# Altium project 继电器板.PrjPcb
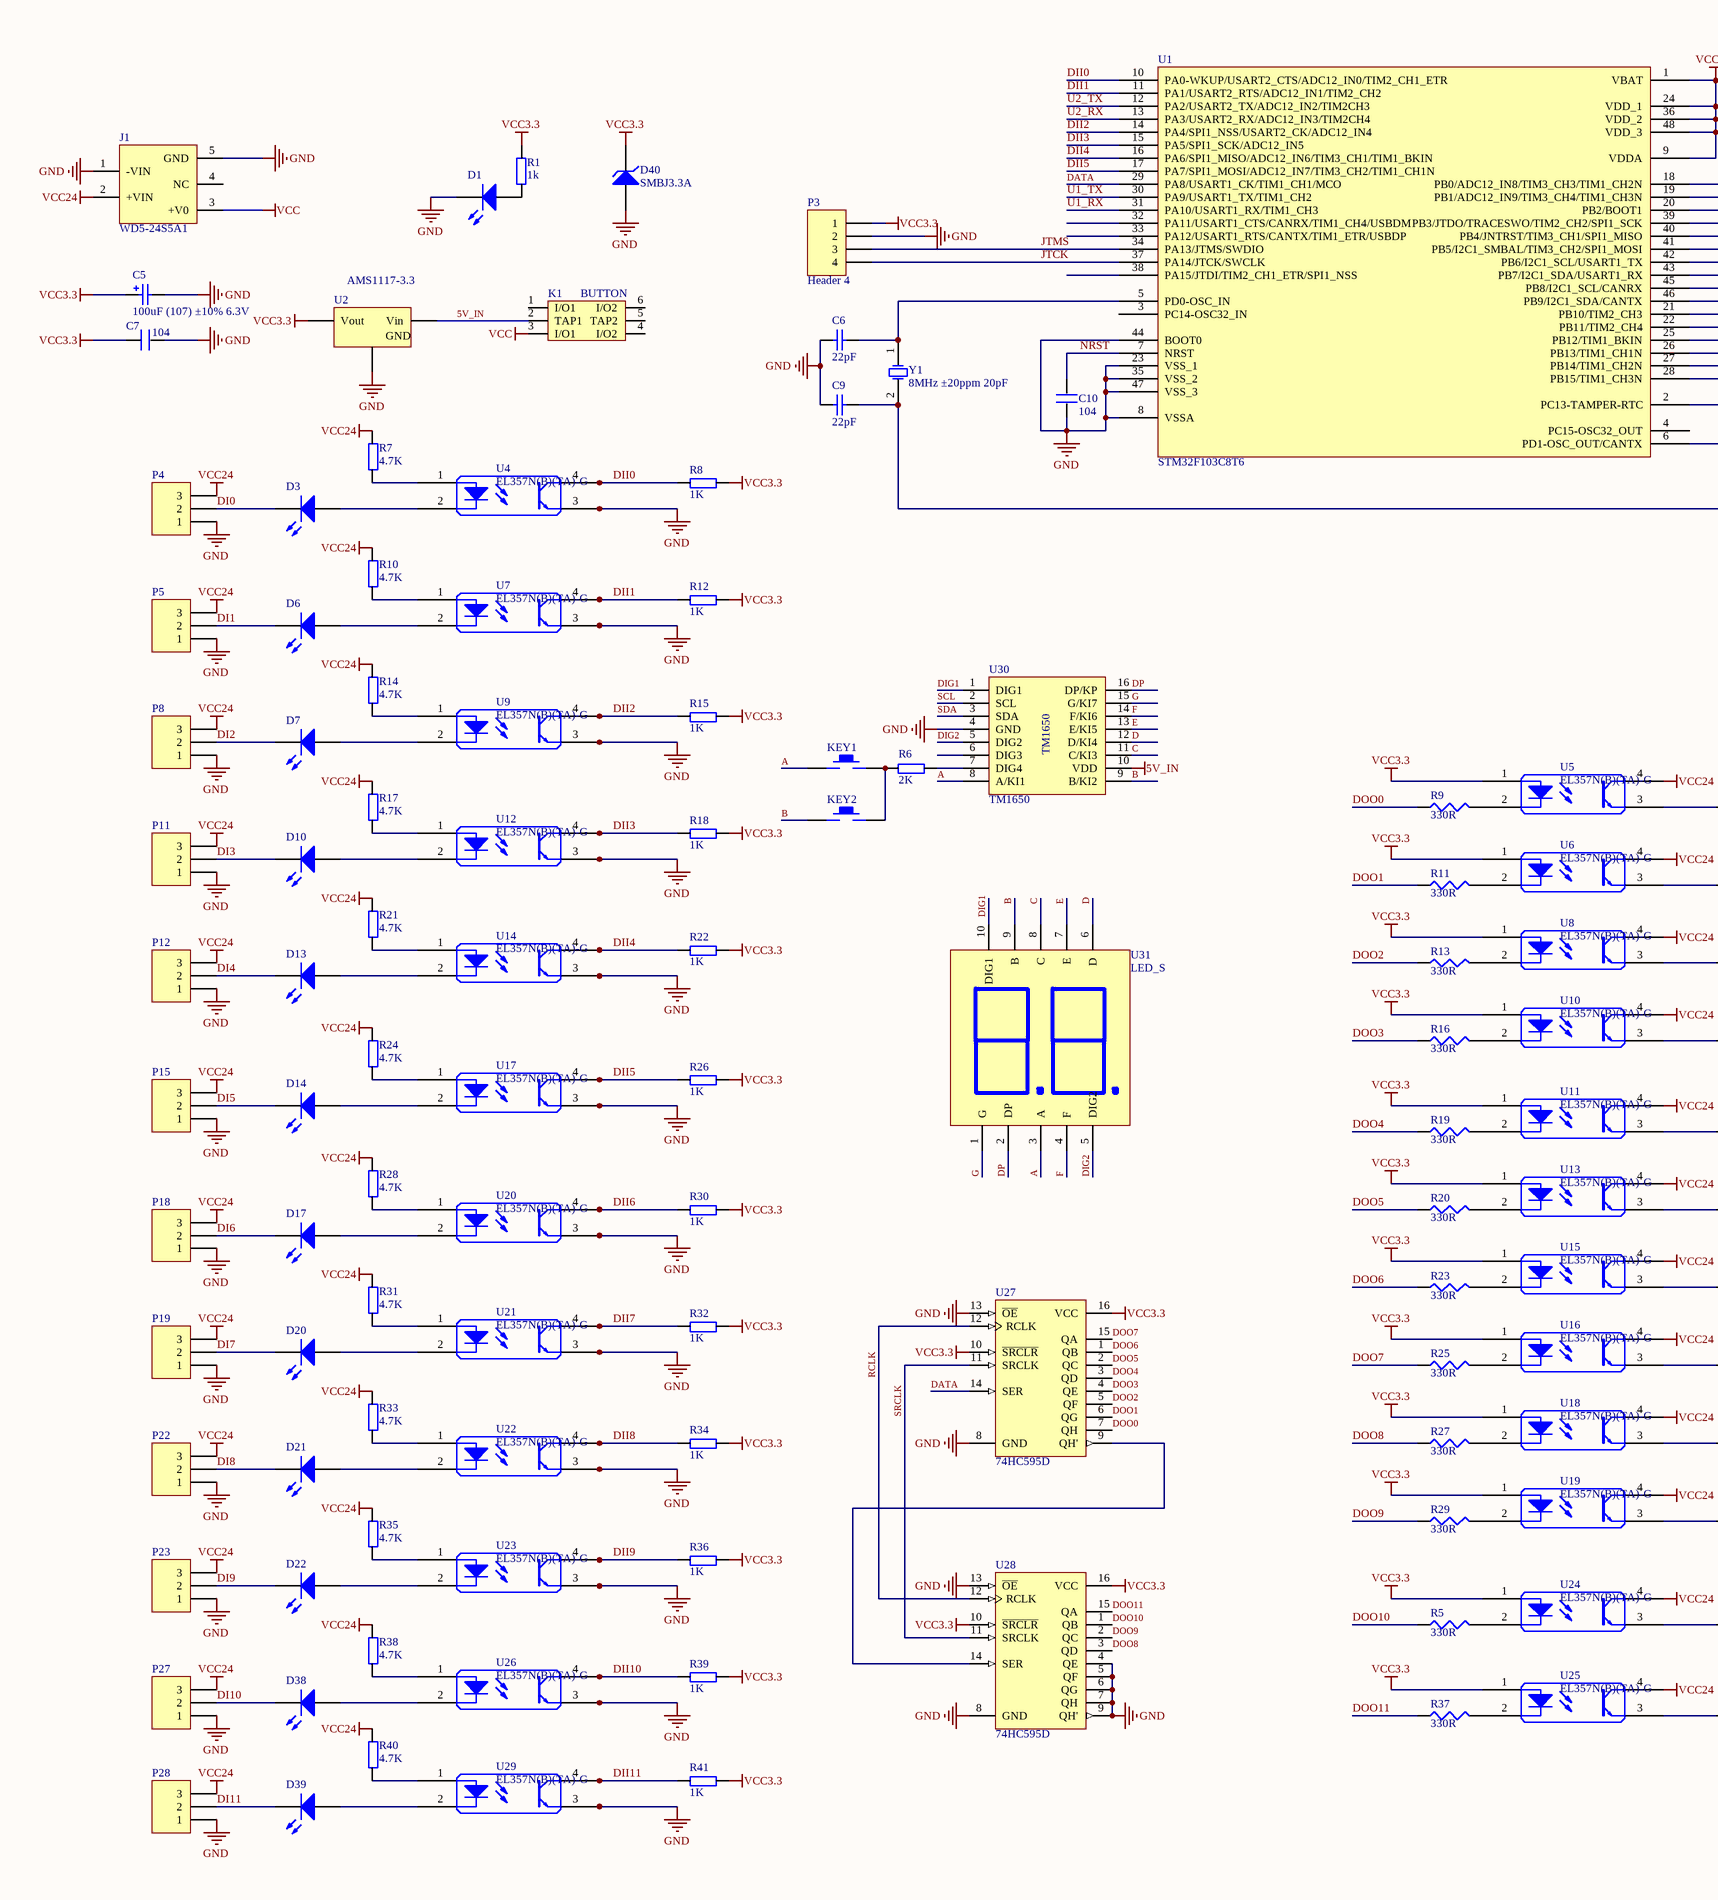
[diagram p0: 继电器板.SchDoc, left]
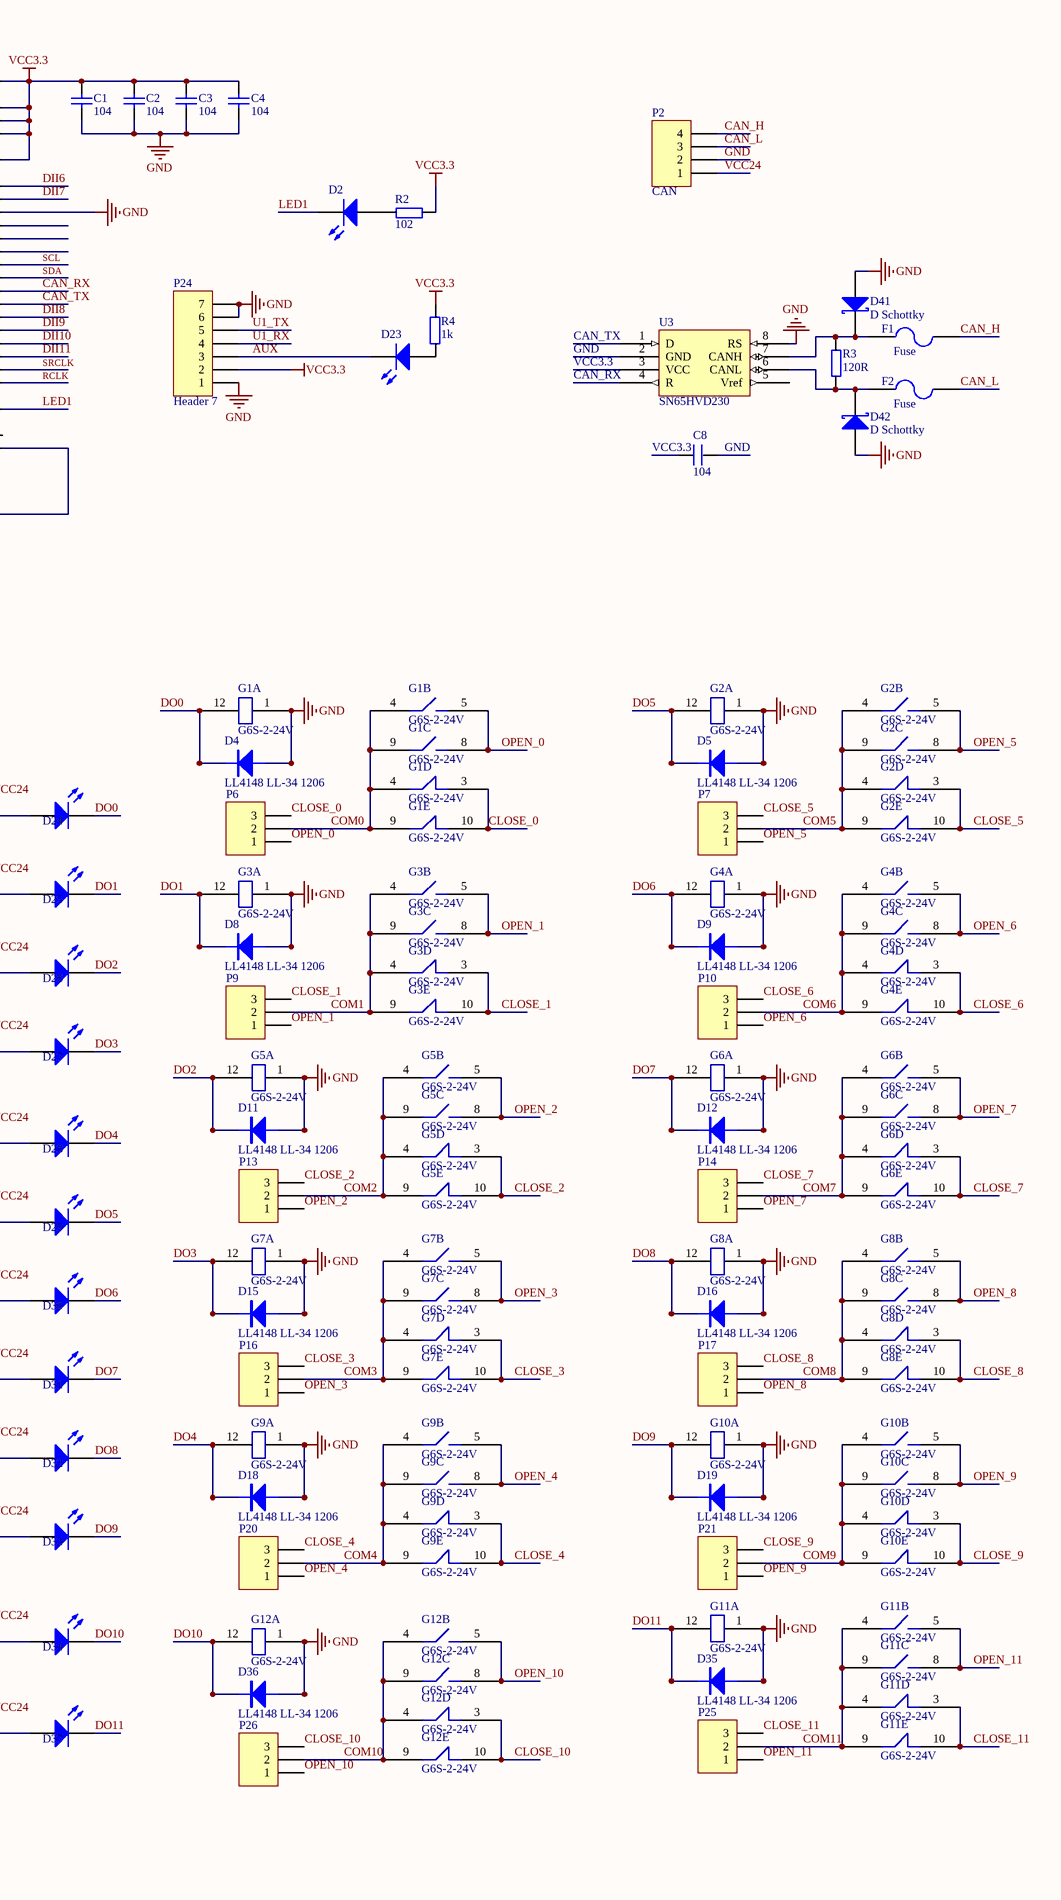
[diagram p1: 继电器板.SchDoc, right]
1 sheet, 170 parts. Net scope: global (net labels, ports and power ports of the same name join across sheets).
Board files: 继电器板.PcbDoc, 尺寸.PcbDoc

## Sheet 继电器板.SchDoc
size A2

### Parts
C1  104  [0603_C]
C2  104  [0603_C]
C3  104  [0603_C]
C4  104  [0603_C]
C5  100uF (107) ±10% 6.3V  [CASE-B_3528]
C6  22pF  [0603_C]
C7  104  [0603_C]
C8  104  [0603_C]
C9  22pF  [0603_C]
C10  104  [0603_C]
D1  蓝灯 0805  [LC-0805_LED_S1]  (value not drawn)
D2  红灯 0805  [LC-0805_LED_S1]  (value not drawn)
D3  红灯 0805  [LC-0805_LED_S1]  (value not drawn)
D4  LL4148 LL-34 1206  [LC-LL-34]
D5  LL4148 LL-34 1206  [LC-LL-34]
D6  红灯 0805  [LC-0805_LED_S1]  (value not drawn)
D7  红灯 0805  [LC-0805_LED_S1]  (value not drawn)
D8  LL4148 LL-34 1206  [LC-LL-34]
D9  LL4148 LL-34 1206  [LC-LL-34]
D10  红灯 0805  [LC-0805_LED_S1]  (value not drawn)
D11  LL4148 LL-34 1206  [LC-LL-34]
D12  LL4148 LL-34 1206  [LC-LL-34]
D13  红灯 0805  [LC-0805_LED_S1]  (value not drawn)
D14  红灯 0805  [LC-0805_LED_S1]  (value not drawn)
D15  LL4148 LL-34 1206  [LC-LL-34]
D16  LL4148 LL-34 1206  [LC-LL-34]
D17  红灯 0805  [LC-0805_LED_S1]  (value not drawn)
D18  LL4148 LL-34 1206  [LC-LL-34]
D19  LL4148 LL-34 1206  [LC-LL-34]
D20  红灯 0805  [LC-0805_LED_S1]  (value not drawn)
D21  红灯 0805  [LC-0805_LED_S1]  (value not drawn)
D22  红灯 0805  [LC-0805_LED_S1]  (value not drawn)
D23  红灯 0805  [LC-0805_LED_S1]  (value not drawn)
D24  红灯 0805  [LC-0805_LED_S1]  (value not drawn)
D25  红灯 0805  [LC-0805_LED_S1]  (value not drawn)
D26  红灯 0805  [LC-0805_LED_S1]  (value not drawn)
D27  红灯 0805  [LC-0805_LED_S1]  (value not drawn)
D28  红灯 0805  [LC-0805_LED_S1]  (value not drawn)
D29  红灯 0805  [LC-0805_LED_S1]  (value not drawn)
D30  红灯 0805  [LC-0805_LED_S1]  (value not drawn)
D31  红灯 0805  [LC-0805_LED_S1]  (value not drawn)
D32  红灯 0805  [LC-0805_LED_S1]  (value not drawn)
D33  红灯 0805  [LC-0805_LED_S1]  (value not drawn)
D34  红灯 0805  [LC-0805_LED_S1]  (value not drawn)
D35  LL4148 LL-34 1206  [LC-LL-34]
D36  LL4148 LL-34 1206  [LC-LL-34]
D37  红灯 0805  [LC-0805_LED_S1]  (value not drawn)
D38  红灯 0805  [LC-0805_LED_S1]  (value not drawn)
D39  红灯 0805  [LC-0805_LED_S1]  (value not drawn)
D40  SMBJ3.3A  [SMB(DO-214AA)_S1]
D41  D Schottky  [SMB]
D42  D Schottky  [SMB]
F1  Fuse  [12Z-2010]
F2  Fuse  [12Z-2010]
G1  G6S-2-24V  [G6S-2-24V]  (parts A,B,C,D,E of 5)
G2  G6S-2-24V  [G6S-2-24V]  (parts A,B,C,D,E of 5)
G3  G6S-2-24V  [G6S-2-24V]  (parts A,B,C,D,E of 5)
G4  G6S-2-24V  [G6S-2-24V]  (parts A,B,C,D,E of 5)
G5  G6S-2-24V  [G6S-2-24V]  (parts A,B,C,D,E of 5)
G6  G6S-2-24V  [G6S-2-24V]  (parts A,B,C,D,E of 5)
G7  G6S-2-24V  [G6S-2-24V]  (parts A,B,C,D,E of 5)
G8  G6S-2-24V  [G6S-2-24V]  (parts A,B,C,D,E of 5)
G9  G6S-2-24V  [G6S-2-24V]  (parts A,B,C,D,E of 5)
G10  G6S-2-24V  [G6S-2-24V]  (parts A,B,C,D,E of 5)
G11  G6S-2-24V  [G6S-2-24V]  (parts A,B,C,D,E of 5)
G12  G6S-2-24V  [G6S-2-24V]  (parts A,B,C,D,E of 5)
J1  WD5-24S5A1  [WD5-24S3V3]
K1  BUTTON  [BTN8.5*8.5]
KEY1  KEY_M  [SW_PB2_A1]  (value not drawn)
KEY2  KEY_M  [SW_PB2_A1]  (value not drawn)
P2  CAN  [DZ-4-3.5]
P3  Header 4  [IDE4]
P4  (no value)  [DZ-3-3.5]
P5  (no value)  [DZ-3-3.5]
P6  (no value)  [DZ-3-3.5]
P7  (no value)  [DZ-3-3.5]
P8  (no value)  [DZ-3-3.5]
P9  (no value)  [DZ-3-3.5]
P10  (no value)  [DZ-3-3.5]
P11  (no value)  [DZ-3-3.5]
P12  (no value)  [DZ-3-3.5]
P13  (no value)  [DZ-3-3.5]
P14  (no value)  [DZ-3-3.5]
P15  (no value)  [DZ-3-3.5]
P16  (no value)  [DZ-3-3.5]
P17  (no value)  [DZ-3-3.5]
P18  (no value)  [DZ-3-3.5]
P19  (no value)  [DZ-3-3.5]
P20  (no value)  [DZ-3-3.5]
P21  (no value)  [DZ-3-3.5]
P22  (no value)  [DZ-3-3.5]
P23  (no value)  [DZ-3-3.5]
P24  Header 7  [AS50-T27]
P25  (no value)  [DZ-3-3.5]
P26  (no value)  [DZ-3-3.5]
P27  (no value)  [DZ-3-3.5]
P28  (no value)  [DZ-3-3.5]
R1  1k  [0603_R]
R2  102  [0603_R]
R3  120R  [0805]
R4  1k  [0603_R]
R5  330R  [0603_R]
R6  2K  [0603_R]
R7  4.7K  [0603_R]
R8  1K  [0603_R]
R9  330R  [0603_R]
R10  4.7K  [0603_R]
R11  330R  [0603_R]
R12  1K  [0603_R]
R13  330R  [0603_R]
R14  4.7K  [0603_R]
R15  1K  [0603_R]
R16  330R  [0603_R]
R17  4.7K  [0603_R]
R18  1K  [0603_R]
R19  330R  [0603_R]
R20  330R  [0603_R]
R21  4.7K  [0603_R]
R22  1K  [0603_R]
R23  330R  [0603_R]
R24  4.7K  [0603_R]
R25  330R  [0603_R]
R26  1K  [0603_R]
R27  330R  [0603_R]
R28  4.7K  [0603_R]
R29  330R  [0603_R]
R30  1K  [0603_R]
R31  4.7K  [0603_R]
R32  1K  [0603_R]
R33  4.7K  [0603_R]
R34  1K  [0603_R]
R35  4.7K  [0603_R]
R36  1K  [0603_R]
R37  330R  [0603_R]
R38  4.7K  [0603_R]
R39  1K  [0603_R]
R40  4.7K  [0603_R]
R41  1K  [0603_R]
U1  STM32F103C8T6  [LC-LQFP-48]
U2  AMS1117-3.3  [SOT-223]
U3  SN65HVD230  [LC-SOIC-8_150mil]
U4  EL357N(B)(TA)-G  [LC-SOP-4_P2.54]
U5  EL357N(B)(TA)-G  [LC-SOP-4_P2.54]
U6  EL357N(B)(TA)-G  [LC-SOP-4_P2.54]
U7  EL357N(B)(TA)-G  [LC-SOP-4_P2.54]
U8  EL357N(B)(TA)-G  [LC-SOP-4_P2.54]
U9  EL357N(B)(TA)-G  [LC-SOP-4_P2.54]
U10  EL357N(B)(TA)-G  [LC-SOP-4_P2.54]
U11  EL357N(B)(TA)-G  [LC-SOP-4_P2.54]
U12  EL357N(B)(TA)-G  [LC-SOP-4_P2.54]
U13  EL357N(B)(TA)-G  [LC-SOP-4_P2.54]
U14  EL357N(B)(TA)-G  [LC-SOP-4_P2.54]
U15  EL357N(B)(TA)-G  [LC-SOP-4_P2.54]
U16  EL357N(B)(TA)-G  [LC-SOP-4_P2.54]
U17  EL357N(B)(TA)-G  [LC-SOP-4_P2.54]
U18  EL357N(B)(TA)-G  [LC-SOP-4_P2.54]
U19  EL357N(B)(TA)-G  [LC-SOP-4_P2.54]
U20  EL357N(B)(TA)-G  [LC-SOP-4_P2.54]
U21  EL357N(B)(TA)-G  [LC-SOP-4_P2.54]
U22  EL357N(B)(TA)-G  [LC-SOP-4_P2.54]
U23  EL357N(B)(TA)-G  [LC-SOP-4_P2.54]
U24  EL357N(B)(TA)-G  [LC-SOP-4_P2.54]
U25  EL357N(B)(TA)-G  [LC-SOP-4_P2.54]
U26  EL357N(B)(TA)-G  [LC-SOP-4_P2.54]
U27  74HC595D  [SOIC-16_150mil]
U28  74HC595D  [SOIC-16_150mil]
U29  EL357N(B)(TA)-G  [LC-SOP-4_P2.54]
U30  TM1650  [SO-16]
U31  LED_S
Y1  8MHz ±20ppm 20pF  [SMD-5032_2P]

### Nets
5V_IN: K1.2(TAP1) U2.3(Vin) U30.10(VDD)
GND: C1.2 C2.2 C3.2 C4.2 C5.2 C6.2 C7.1 C8.2 C9.2 C10.1 D1.K D4.1(A) D5.1(A) D8.1(A) D9.1(A) D11.1(A) D12.1(A) D15.1(A) D16.1(A) D18.1(A) D19.1(A) D35.1(A) D36.1(A) D40.1(A) D41.1(A) D42.1(A) G1.1 G2.1 G3.1 G4.1 G5.1 G6.1 G7.1 G8.1 G9.1 G10.1 G11.1 G12.1 J1.1(-VIN) J1.5(GND) P2.2 P3.2 P4.1 P5.1 P8.1 P11.1 P12.1 P15.1 P18.1 P19.1 P22.1 P23.1 P24.1 P24.6 P24.7 P27.1 P28.1 U1.8(VSSA) U1.20(PB2/BOOT1) U1.23(VSS_1) U1.35(VSS_2) U1.44(BOOT0) U1.47(VSS_3) U2.1(GND) U3.2(GND) U3.8(RS) U4.3 U7.3 U9.3 U12.3 U14.3 U17.3 U20.3 U21.3 U22.3 U23.3 U26.3 U27.8(GND) U27.13(~{OE}) U28.4(QE) U28.5(QF) U28.6(QG) U28.7(QH) U28.8(GND) U28.9(QH') U28.13(~{OE}) U29.3 U30.4(GND)
VCC: J1.3(+V0) K1.3(I/O1)
VCC3.3: C1.1 C2.1 C3.1 C4.1 C5.1 C7.2 C8.1 D40.2(K) P3.1 P24.2 R1.1 R2.2 R4.1 R8.2 R12.2 R15.2 R18.2 R22.2 R26.2 R30.2 R32.2 R34.2 R36.2 R39.2 R41.2 U1.1(VBAT) U1.9(VDDA) U1.24(VDD_1) U1.36(VDD_2) U1.48(VDD_3) U2.2(Vout) U3.3(VCC) U5.1 U6.1 U8.1 U10.1 U11.1 U13.1 U15.1 U16.1 U18.1 U19.1 U24.1 U25.1 U27.10(~{SRCLR}) U27.16(VCC) U28.10(~{SRCLR}) U28.16(VCC)
VCC24: J1.2(+VIN) P2.1 P4.3 P5.3 P8.3 P11.3 P12.3 P15.3 P18.3 P19.3 P22.3 P23.3 P27.3 P28.3 R7.2 R10.2 R14.2 R17.2 R21.2 R24.2 R28.2 R31.2 R33.2 R35.2 R38.2 R40.2 U5.4 U6.4 U8.4 U10.4 U11.4 U13.4 U15.4 U16.4 U18.4 U19.4 U24.4 U25.4
A: KEY1.1 U30.8(A/KI1) U31.3(A)
AUX: D23.K P24.3
B: KEY2.1 U30.9(B/KI2) U31.9(B)
C: U30.11(C/KI3) U31.8(C)
CAN_H: F1.1 P2.4
CAN_L: F2.1 P2.3
CAN_RX: U1.45(PB8/I2C1_SCL/CANRX) U3.4(R)
CAN_TX: U1.46(PB9/I2C1_SDA/CANTX) U3.1(D)
CLOSE_0: G1.3 G1.10 P6.3
CLOSE_1: G3.3 G3.10 P9.3
CLOSE_2: G5.3 G5.10 P13.3
CLOSE_3: G7.3 G7.10 P16.3
CLOSE_4: G9.3 G9.10 P20.3
CLOSE_5: G2.3 G2.10 P7.3
CLOSE_6: G4.3 G4.10 P10.3
CLOSE_7: G6.3 G6.10 P14.3
CLOSE_8: G8.3 G8.10 P17.3
CLOSE_9: G10.3 G10.10 P21.3
CLOSE_10: G12.3 G12.10 P26.3
CLOSE_11: G11.3 G11.10 P25.3
COM0: G1.4 G1.9 P6.2
COM1: G3.4 G3.9 P9.2
COM2: G5.4 G5.9 P13.2
COM3: G7.4 G7.9 P16.2
COM4: G9.4 G9.9 P20.2
COM5: G2.4 G2.9 P7.2
COM6: G4.4 G4.9 P10.2
COM7: G6.4 G6.9 P14.2
COM8: G8.4 G8.9 P17.2
COM9: G10.4 G10.9 P21.2
COM10: G12.4 G12.9 P26.2
COM11: G11.4 G11.9 P25.2
D: U30.12(D/KI4) U31.6(D)
DATA: U1.29(PA8/USART1_CK/TIM1_CH1/MCO) U27.14(SER)
DI0: D3.K P4.2
DI1: D6.K P5.2
DI2: D7.K P8.2
DI3: D10.K P11.2
DI4: D13.K P12.2
DI5: D14.K P15.2
DI6: D17.K P18.2
DI7: D20.K P19.2
DI8: D21.K P22.2
DI9: D22.K P23.2
DI10: D38.K P27.2
DI11: D39.K P28.2
DIG1: U30.1(DIG1) U31.10(DIG1)
DIG2: U30.5(DIG2) U31.5(DIG2)
DII0: R8.1 U1.10(PA0-WKUP/USART2_CTS/ADC12_IN0/TIM2_CH1_ETR) U4.4
DII1: R12.1 U1.11(PA1/USART2_RTS/ADC12_IN1/TIM2_CH2) U7.4
DII2: R15.1 U1.14(PA4/SPI1_NSS/USART2_CK/ADC12_IN4) U9.4
DII3: R18.1 U1.15(PA5/SPI1_SCK/ADC12_IN5) U12.4
DII4: R22.1 U1.16(PA6/SPI1_MISO/ADC12_IN6/TIM3_CH1/TIM1_BKIN) U14.4
DII5: R26.1 U1.17(PA7/SPI1_MOSI/ADC12_IN7/TIM3_CH2/TIM1_CH1N) U17.4
DII6: R30.1 U1.18(PB0/ADC12_IN8/TIM3_CH3/TIM1_CH2N) U20.4
DII7: R32.1 U1.19(PB1/ADC12_IN9/TIM3_CH4/TIM1_CH3N) U21.4
DII8: R34.1 U1.21(PB10/TIM2_CH3) U22.4
DII9: R36.1 U1.22(PB11/TIM2_CH4) U23.4
DII10: R39.1 U1.25(PB12/TIM1_BKIN) U26.4
DII11: R41.1 U1.26(PB13/TIM1_CH1N) U29.4
DO0: D4.2(K) D24.K G1.12
DO1: D8.2(K) D25.K G3.12
DO2: D11.2(K) D26.K G5.12
DO3: D15.2(K) D27.K G7.12
DO4: D18.2(K) D28.K G9.12
DO5: D5.2(K) D29.K G2.12
DO6: D9.2(K) D30.K G4.12
DO7: D12.2(K) D31.K G6.12
DO8: D16.2(K) D32.K G8.12
DO9: D19.2(K) D33.K G10.12
DO10: D34.K D36.2(K) G12.12
DO11: D35.2(K) D37.K G11.12
DOO0: R9.1 U27.7(QH)
DOO1: R11.1 U27.6(QG)
DOO2: R13.1 U27.5(QF)
DOO3: R16.1 U27.4(QE)
DOO4: R19.1 U27.3(QD)
DOO5: R20.1 U27.2(QC)
DOO6: R23.1 U27.1(QB)
DOO7: R25.1 U27.15(QA)
DOO8: R27.1 U28.3(QD)
DOO9: R29.1 U28.2(QC)
DOO10: R5.1 U28.1(QB)
DOO11: R37.1 U28.15(QA)
DP: U30.16(DP/KP) U31.2(DP)
E: U30.13(E/KI5) U31.7(E)
F: U30.14(F/KI6) U31.4(F)
G: U30.15(G/KI7) U31.1(G)
JTCK: P3.4 U1.37(PA14/JTCK/SWCLK)
JTMS: P3.3 U1.34(PA13/JTMS/SWDIO)
LED1: D2.K U1.2(PC13-TAMPER-RTC)
NRST: C10.2 U1.7(NRST)
OPEN_0: G1.5 G1.8 P6.1
OPEN_1: G3.5 G3.8 P9.1
OPEN_2: G5.5 G5.8 P13.1
OPEN_3: G7.5 G7.8 P16.1
OPEN_4: G9.5 G9.8 P20.1
OPEN_5: G2.5 G2.8 P7.1
OPEN_6: G4.5 G4.8 P10.1
OPEN_7: G6.5 G6.8 P14.1
OPEN_8: G8.5 G8.8 P17.1
OPEN_9: G10.5 G10.8 P21.1
OPEN_10: G12.5 G12.8 P26.1
OPEN_11: G11.5 G11.8 P25.1
RCLK: U1.28(PB15/TIM1_CH3N) U27.12(RCLK) U28.12(RCLK)
SCL: U1.42(PB6/I2C1_SCL/USART1_TX) U30.2(SCL)
SDA: U1.43(PB7/I2C1_SDA/USART1_RX) U30.3(SDA)
SRCLK: U1.27(PB14/TIM1_CH2N) U27.11(SRCLK) U28.11(SRCLK)
U1_RX: P24.4 U1.31(PA10/USART1_RX/TIM1_CH3)
U1_TX: P24.5 U1.30(PA9/USART1_TX/TIM1_CH2)
U2_RX: U1.13(PA3/USART2_RX/ADC12_IN3/TIM2CH4)
U2_TX: U1.12(PA2/USART2_TX/ADC12_IN2/TIM2CH3)
NetC6_1: C6.1 U1.5(PD0-OSC_IN) Y1.1(OSC1)
NetC9_1: C9.1 U1.6(PD1-OSC_OUT/CANTX) Y1.2(OSC2)
NetD1_A: D1.A R1.2
NetD2_A: D2.A R2.1
NetD3_A: D3.A U4.2
NetD6_A: D6.A U7.2
NetD7_A: D7.A U9.2
NetD10_A: D10.A U12.2
NetD13_A: D13.A U14.2
NetD14_A: D14.A U17.2
NetD17_A: D17.A U20.2
NetD20_A: D20.A U21.2
NetD21_A: D21.A U22.2
NetD22_A: D22.A U23.2
NetD23_A: D23.A R4.2
NetD24_A: D24.A U5.3
NetD25_A: D25.A U6.3
NetD26_A: D26.A U8.3
NetD27_A: D27.A U10.3
NetD28_A: D28.A U11.3
NetD29_A: D29.A U13.3
NetD30_A: D30.A U15.3
NetD31_A: D31.A U16.3
NetD32_A: D32.A U18.3
NetD33_A: D33.A U19.3
NetD34_A: D34.A U24.3
NetD37_A: D37.A U25.3
NetD38_A: D38.A U26.2
NetD39_A: D39.A U29.2
NetD41_2: D41.2(K) F1.2 R3.2 U3.7(CANH)
NetD42_2: D42.2(K) F2.2 R3.1 U3.6(CANL)
NetKEY1_2: KEY1.2 KEY2.2 R6.1
NetR5_2: R5.2 U24.2
NetR6_2: R6.2 U30.7(DIG4)
NetR7_1: R7.1 U4.1
NetR9_2: R9.2 U5.2
NetR10_1: R10.1 U7.1
NetR11_2: R11.2 U6.2
NetR13_2: R13.2 U8.2
NetR14_1: R14.1 U9.1
NetR16_2: R16.2 U10.2
NetR17_1: R17.1 U12.1
NetR19_2: R19.2 U11.2
NetR20_2: R20.2 U13.2
NetR21_1: R21.1 U14.1
NetR23_2: R23.2 U15.2
NetR24_1: R24.1 U17.1
NetR25_2: R25.2 U16.2
NetR27_2: R27.2 U18.2
NetR28_1: R28.1 U20.1
NetR29_2: R29.2 U19.2
NetR31_1: R31.1 U21.1
NetR33_1: R33.1 U22.1
NetR35_1: R35.1 U23.1
NetR37_2: R37.2 U25.2
NetR38_1: R38.1 U26.1
NetR40_1: R40.1 U29.1
NetU27_9: U27.9(QH') U28.14(SER)

Not connected (* = marked no-connect by the designer): J1 4(NC); K1 1(I/O1) 4(I/O2) 5(TAP2) 6(I/O2); U1 3(PC14-OSC32_IN) 4(PC15-OSC32_OUT) 32(PA11/USART1_CTS/CANRX/TIM1_CH4/USBDM) 33(PA12/USART1_RTS/CANTX/TIM1_ETR/USBDP) 38(PA15/JTDI/TIM2_CH1_ETR/SPI1_NSS) 39(PB3/JTDO/TRACESWO/TIM2_CH2/SPI1_SCK) 40(PB4/JNTRST/TIM3_CH1/SPI1_MISO) 41(PB5/I2C1_SMBAL/TIM3_CH2/SPI1_MOSI); U3 5(Vref); U30 6(DIG3)

### Library data of the parts
C1-C4 C9 = Cap: Capacitor; Published: 8-Jun-2000; LatestRevisionDate: 17-Jul-2002; LatestRevisionNote: Re-released for DXP Platform.; PackageReference: RAD-0.3; Publisher: Altium Limited; PackageDescription: Radial Cap, Thru-Hole; 2 Leads; 0.3 in Pin Spacing
  C1-C4: Value: 104
  C9: Value: 22pF
C5 = 3528 100uF (107) 10% 6.3V: 钽电容; ComponentLink1Description: 供应商链接; ComponentLink1URL: http://www.szlcsc.com/product/details_16815.html; Package: 3528; Supplier: LC; SuppliersPartNumber: C16133
C6 = Cap: Capacitor; Value: 22p; Published: 8-Jun-2000; LatestRevisionDate: 17-Jul-2002; LatestRevisionNote: Re-released for DXP Platform.; PackageReference: RAD-0.3; Publisher: Altium Limited; PackageDescription: Radial Cap, Thru-Hole; 2 Leads; 0.3 in Pin Spacing
C7 C10 = C
C8 = C_3
D1-D3 D6 D7 D10 D13 D14 D17 D20-D34 D37-D39 = LED0: Typical INFRARED GaAs LED; Published: 8-Jun-2000; LatestRevisionDate: 08-Jul-2005; LatestRevisionNote: Mech Layer 1 removed.; PackageReference: LED-0; Publisher: Altium Limited; PackageDescription: LED; 2 Leads
D4 D5 D8 D9 D11 D12 D15 D16 D18 D19 D35 D36 = DIODE
D40 = D Zener: Zener Diode; Published: 8-Jun-2000; LatestRevisionDate: 17-Jul-2002; LatestRevisionNote: Re-released for DXP Platform.; PackageReference: DIODE-0.7; Publisher: Altium Limited; PackageDescription: Diode, Thru-Hole; 2 Leads; 0.7 in Pin Spacing
D41 D42 = D Schottky: Schottky Diode; Published: 8-Jun-2000; LatestRevisionDate: 17-Jul-2002; LatestRevisionNote: Re-released for DXP Platform.; PackageReference: SMB; Publisher: Altium Limited; PackageDescription: DO-214-AA/SMB; 2 C-Bend Leads; Body 5.3 x 3.6 mm, inc. leads (LxW); Code_JEDEC: DO-214-AA
F1 F2 = Fuse 2: Published: 8-Jun-2000; LatestRevisionDate: 17-Jul-2002; LatestRevisionNote: Re-released for DXP Platform.; PackageReference: PIN-W2/E2.8; Publisher: Altium Limited; PackageDescription: Thru-Hole; 2 Leads
G1-G12 = (no symbol name): G5SB-14-24VDC
J1 = WD5-24S3V3A1
P2 P3 = Header 4: Header, 4-Pin; LatestRevisionDate: 17-Jul-2002; LatestRevisionNote: Re-released for DXP Platform.; Publisher: Altium Limited
P4-P23 P25-P28 = Header 3: Header, 3-Pin; LatestRevisionDate: 17-Jul-2002; LatestRevisionNote: Re-released for DXP Platform.; Publisher: Altium Limited
P24 = Header 7: Header, 7-Pin; LatestRevisionDate: 17-Jul-2002; LatestRevisionNote: Re-released for DXP Platform.; Publisher: Altium Limited
R1-R4 R6-R8 R10 R12 R14 R15 R17 R18 R21 R22 R24 R26 R28 R30-R36 R38-R41 = R_2
R5 R9 R11 R13 R16 R19 R20 R23 R25 R27 R29 R37 = RES1
U1 = stm32f103v8t6
U2 = SOT-223 AMS1117-3.3: 低压差线性稳压(LDO); ComponentLink1Description: 供应商链接; ComponentLink1URL: http://www.szlcsc.com/product/details_6652.html; Package: SOT-223; Supplier: LC; SuppliersPartNumber: C6186
U3 = SN65HVD230D
U4-U26 U29 = 2701
U27 U28 = 74HC595D: 74系列逻辑芯片; ComponentLink1Description: 供应商链接; ComponentLink1URL: http://www.szlcsc.com/product/details_6413.html; Package: SOIC-16_150mil; Supplier: LC; SuppliersPartNumber: C5947
Y1 = SMD-5032_2P 8MHz 20ppm 20pF: 贴片晶振; ComponentLink1Description: 供应商链接; ComponentLink1URL: http://www.szlcsc.com/product/details_117214.html; Package: SMD-5032_2P; Supplier: LC; SuppliersPartNumber: C115962